# Altium schematic sheet PCB.SchDoc
size A
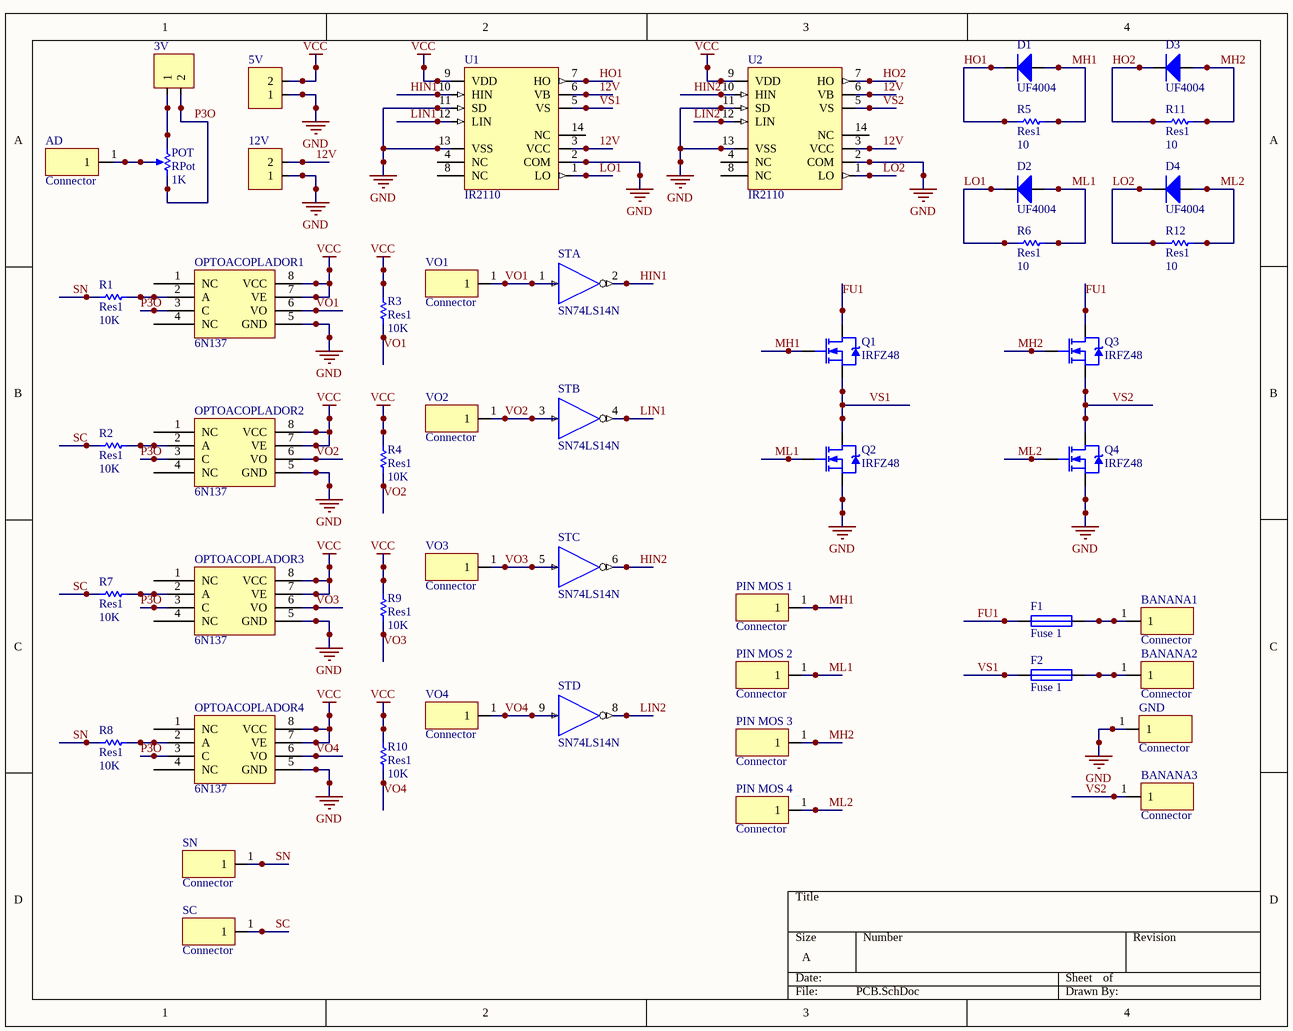
[diagram p0: PCB.SchDoc]

## Parts
3V  WE-Terminal Blocks Screw Type 691214110002  [691214110002]  (value not drawn)
5V  WE-Terminal Blocks Screw Type 691214110002  [691214110002]  (value not drawn)
12V  WE-Terminal Blocks Screw Type 691214110002  [691214110002]  (value not drawn)
AD  Connector  [1x1x2.54 Pin Header TH V]
BANANA1  Connector  [1x1x2.54 Pin Header TH V]
BANANA2  Connector  [1x1x2.54 Pin Header TH V]
BANANA3  Connector  [1x1x2.54 Pin Header TH V]
D1  UF4004  [DO-35]
D2  UF4004  [DO-35]
D3  UF4004  [DO-35]
D4  UF4004  [DO-35]
F1  Fuse 1  [PIN-W2/E2.8]
F2  Fuse 1  [PIN-W2/E2.8]
GND  Connector  [1x1x2.54 Pin Header TH V]
OPTOACOPLADOR1  6N137  [*DIP762W50P254L977H451Q8]
OPTOACOPLADOR2  6N137  [*DIP762W50P254L977H451Q8]
OPTOACOPLADOR3  6N137  [*DIP762W50P254L977H451Q8]
OPTOACOPLADOR4  6N137  [*DIP762W50P254L977H451Q8]
PIN_MOS_1  Connector  [1x1x2.54 Pin Header TH V]
PIN_MOS_2  Connector  [1x1x2.54 Pin Header TH V]
PIN_MOS_3  Connector  [1x1x2.54 Pin Header TH V]
PIN_MOS_4  Connector  [1x1x2.54 Pin Header TH V]
POT  RPot  value 1K  [VR5]
Q1  IRFZ48  [TO-220AB]
Q2  IRFZ48  [TO-220AB]
Q3  IRFZ48  [TO-220AB]
Q4  IRFZ48  [TO-220AB]
R1  Res1  value 10K  [AXIAL-0.3]
R2  Res1  value 10K  [AXIAL-0.3]
R3  Res1  value 10K  [AXIAL-0.3]
R4  Res1  value 10K  [AXIAL-0.3]
R5  Res1  value 10  [AXIAL-0.3]
R6  Res1  value 10  [AXIAL-0.3]
R7  Res1  value 10K  [AXIAL-0.3]
R8  Res1  value 10K  [AXIAL-0.3]
R9  Res1  value 10K  [AXIAL-0.3]
R10  Res1  value 10K  [AXIAL-0.3]
R11  Res1  value 10  [AXIAL-0.3]
R12  Res1  value 10  [AXIAL-0.3]
SC  Connector  [1x1x2.54 Pin Header TH V]
SN  Connector  [1x1x2.54 Pin Header TH V]
ST  SN74LS14N  [N014]  (parts A,B,C,D of 6)
U1  IR2110  [PDIP14]
U2  IR2110  [PDIP14]
VO1  Connector  [1x1x2.54 Pin Header TH V]
VO2  Connector  [1x1x2.54 Pin Header TH V]
VO3  Connector  [1x1x2.54 Pin Header TH V]
VO4  Connector  [1x1x2.54 Pin Header TH V]

## Nets
GND: 5V.1 12V.1 GND.1 OPTOACOPLADOR1.5(GND) OPTOACOPLADOR2.5(GND) OPTOACOPLADOR3.5(GND) OPTOACOPLADOR4.5(GND) Q2.3(S) Q4.3(S) ST.7(GND) U1.2(COM) U1.11(SD) U1.13(VSS) U2.2(COM) U2.11(SD) U2.13(VSS)
VCC: 5V.2 OPTOACOPLADOR1.7(VE) OPTOACOPLADOR1.8(VCC) OPTOACOPLADOR2.7(VE) OPTOACOPLADOR2.8(VCC) OPTOACOPLADOR3.7(VE) OPTOACOPLADOR3.8(VCC) OPTOACOPLADOR4.7(VE) OPTOACOPLADOR4.8(VCC) R3.2 R4.2 R9.2 R10.2 ST.14(VCC) U1.9(VDD) U2.9(VDD)
12V: 12V.2 U1.3(VCC) U1.6(VB) U2.3(VCC) U2.6(VB)
FU1: F1.2 Q1.2(D) Q3.2(D)
HIN1: ST.2(Y) U1.10(HIN)
HIN2: ST.6(Y) U2.10(HIN)
HO1: D1.2(K) R5.1 U1.7(HO)
HO2: D3.2(K) R11.1 U2.7(HO)
LIN1: ST.4(Y) U1.12(LIN)
LIN2: ST.8(Y) U2.12(LIN)
LO1: D2.2(K) R6.1 U1.1(LO)
LO2: D4.2(K) R12.1 U2.1(LO)
MH1: D1.1(A) PIN_MOS_1.1 Q1.1(G) R5.2
MH2: D3.1(A) PIN_MOS_3.1 Q3.1(G) R11.2
ML1: D2.1(A) PIN_MOS_2.1 Q2.1(G) R6.2
ML2: D4.1(A) PIN_MOS_4.1 Q4.1(G) R12.2
P3O: 3V.2 OPTOACOPLADOR1.3(C) OPTOACOPLADOR2.3(C) OPTOACOPLADOR3.3(C) OPTOACOPLADOR4.3(C) POT.2(BOT)
SC: R2.1 R7.1 SC.1
SN: R1.1 R8.1 SN.1
VO1: OPTOACOPLADOR1.6(VO) R3.1 ST.1(A) VO1.1
VO2: OPTOACOPLADOR2.6(VO) R4.1 ST.3(A) VO2.1
VO3: OPTOACOPLADOR3.6(VO) R9.1 ST.5(A) VO3.1
VO4: OPTOACOPLADOR4.6(VO) R10.1 ST.9(A) VO4.1
VS1: F2.1 Q1.3(S) Q2.2(D) U1.5(VS)
VS2: BANANA3.1 Q3.3(S) Q4.2(D) U2.5(VS)
Net3V_1: 3V.1 POT.1(TOP)
NetAD_1: AD.1 POT.3(TAP)
NetBANANA1_1: BANANA1.1 F1.1
NetBANANA2_1: BANANA2.1 F2.2
NetOPTOACOPLADOR1_2: OPTOACOPLADOR1.2(A) R1.2
NetOPTOACOPLADOR2_2: OPTOACOPLADOR2.2(A) R2.2
NetOPTOACOPLADOR3_2: OPTOACOPLADOR3.2(A) R7.2
NetOPTOACOPLADOR4_2: OPTOACOPLADOR4.2(A) R8.2

Not connected (* = marked no-connect by the designer): OPTOACOPLADOR1 1(NC) 4(NC); OPTOACOPLADOR2 1(NC) 4(NC); OPTOACOPLADOR3 1(NC) 4(NC); OPTOACOPLADOR4 1(NC) 4(NC); U1 4(NC) 8(NC) 14(NC); U2 4(NC) 8(NC) 14(NC)

## Library data of the parts
3V 5V 12V = WE-Terminal Blocks Screw Type 691214110002: WR-TBL Terminal block - serie 2141 - 3.5mm; Manufacturer: W¨¹rth Elektronik eiSos GmbH; ComponentLink1 Description: Manufacturer; ComponentLink2 Description: Datasheet; NoPins: 2; Created Date: 8 Novenber 2013; partNo: 691214110002; ComponentLink1URL: http://www.we-online.com; ComponentLink2URL: http://katalog.we-online.de/em/datasheet/6912141100xx.pdf; Created by: Karrer Zheng
AD BANANA1-BANANA3 GND PIN_MOS_1-PIN_MOS_4 SC SN VO1-VO4 = Header 1x1
D1-D4 = FDH333: High Conductance Low Leakage Diode; Published: 8-Jun-2000; LatestRevisionDate: 17-Jul-2002; LatestRevisionNote: Re-released for DXP Platform.; DatasheetDocument: 1997; PackageReference: DO-35; Publisher: Altium Limited; Code_JEDEC: DO-204-AH; ComponentLink1Description: Manufacturer Link; ComponentLink1URL: http://www.fairchildsemi.com/; ComponentLink2Description: Datasheet; ComponentLink2URL: http://www.fairchildsemi.com/ds/FD/FDH333.pdf
F1 F2 = Fuse 1: Fuse; Published: 8-Jun-2000; LatestRevisionDate: 17-Jul-2002; LatestRevisionNote: Re-released for DXP Platform.; PackageReference: PIN-W2/E2.8; Publisher: Altium Limited; PackageDescription: Thru-Hole; 2 Leads
OPTOACOPLADOR1-OPTOACOPLADOR4 = 6N137: High CMR, High Speed TTL Compatible Optocouplers; MF: Everlight Electronics; Digi-Key_Part_Number: 751-1262-5-ND; SnapEDA_Link: https://www.snapeda.com/parts/6N137/Everlight%20Electronics%20Co%20Ltd/view-part/?ref=snap; MP: 6N137; Digi-Key_Purchase_URL: https://www.digikey.ec/product-detail/en/vishay-semiconductor-opto-division/6N137/751-1262-5-ND/1731495?utm_source=snapeda&utm_medium=aggregator&utm_campaign=symbol; Package: DIP-8 Broadcom; Value: *
POT = RPot: Potentiometer; Sim Note: Enter the Resistance value and the set point into parameter fields.; Set Position: 0.5; Published: 8-Jun-2000; LatestRevisionDate: 17-Jul-2002; LatestRevisionNote: Re-released for DXP Platform.; PackageReference: VR5; Publisher: Altium Limited; PackageDescription: Variable Resistor, Thru-Hole; 3 Leads
Q1-Q4 = IRFZ48: HEXFET N-Channel Power MOSFET; Note: Pin 2 is electrically connected to pin 4.; Published: 8-Jun-2000; LatestRevisionDate: 17-Jul-2002; LatestRevisionNote: Re-released for DXP Platform.; DatasheetVersion: PD-9.758; PackageVersion: Feb-1997; PackageReference: TO-220AB; Publisher: Altium Limited; PackageDescription: TO, Thru-Hole, Vertical, Heatsink Mounted; 3 In-Line Leads; Pitch 2.54 mm; ComponentLink1Description: Manufacturer Link; ComponentLink1URL: http://www.irf.com/; ComponentLink2Description: Datasheet; ComponentLink2URL: http://www.irf.com/product-info/datasheets/data/irfz48.pdf
R1-R12 = Res1: Resistor; Published: 8-Jun-2000; LatestRevisionDate: 17-Jul-2002; LatestRevisionNote: Re-released for DXP Platform.; PackageReference: AXIAL-0.3; Publisher: Altium Limited; PackageDescription: Axial Device, Thru-Hole; 2 Leads; 0.3 in Pin Spacing
ST = SN74LS14N: Hex Schmitt-Trigger Inverter; Published: 8-Jun-2000; LatestRevisionDate: 04-Mar-2005; LatestRevisionNote: Stylized 3D Model Added.; DatasheetVersion: Mar-1988; PackageVersion: Oct-1995; PackageReference: N014; Publisher: Altium Limited; PackageDescription: DIP; 14 Leads; Row Spacing 7.62 mm; Pitch 2.54 mm; ComponentLink1Description: Manufacturer Link; ComponentLink1URL: http://www.ti.com/; ComponentLink2Description: Datasheet; ComponentLink2URL: http://www-s.ti.com/sc/ds/sn74ls14.pdf
U1 U2 = IR2110: High and Low Side Driver; Note: Pins 4, 8 and 14 are not connected; Published: 8-Jun-2000; LatestRevisionDate: 04-Mar-2005; LatestRevisionNote: Stylized 3D Model Added.; DatasheetVersion: PD60147J; PackageReference: PDIP14; Publisher: Altium Limited; PackageDescription: DIP; 14 Leads; Row Spacing 7.62 mm; Pitch 2.54 mm; ComponentLink1Description: Manufacturer Link; ComponentLink1URL: http://www.irf.com/; ComponentLink2Description: Datasheet; ComponentLink2URL: http://www.irf.com/product-info/datasheets/data/ir2110.pdf